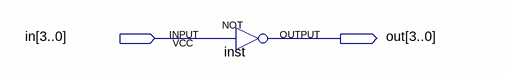
[diagram p0: schematic sheet]
// Quartus schematic inversor.bdf as structural Verilog: 1 symbols, 2 pins
module inversor (
  input  [3:0] in,
  output [3:0] out
);

  assign out = ~in;  // NOT inst, 4 bits wide
endmodule
